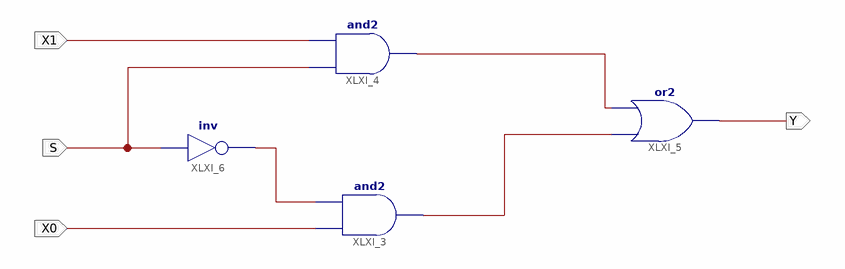
[diagram p0: schematic sheet 1]
// Xilinx ISE schematic mux2.sch (spartan3e) as structural Verilog: 4 symbols, 4 ports
module mux2 (
  input  X1,
  input  X0,
  input  S,
  output Y
);

  wire XLXN_15, XLXN_16, XLXN_19;

  and XLXI_3 (XLXN_16, X0, XLXN_19);
  and XLXI_4 (XLXN_15, S, X1);
  or XLXI_5 (Y, XLXN_16, XLXN_15);
  not XLXI_6 (XLXN_19, S);
endmodule
